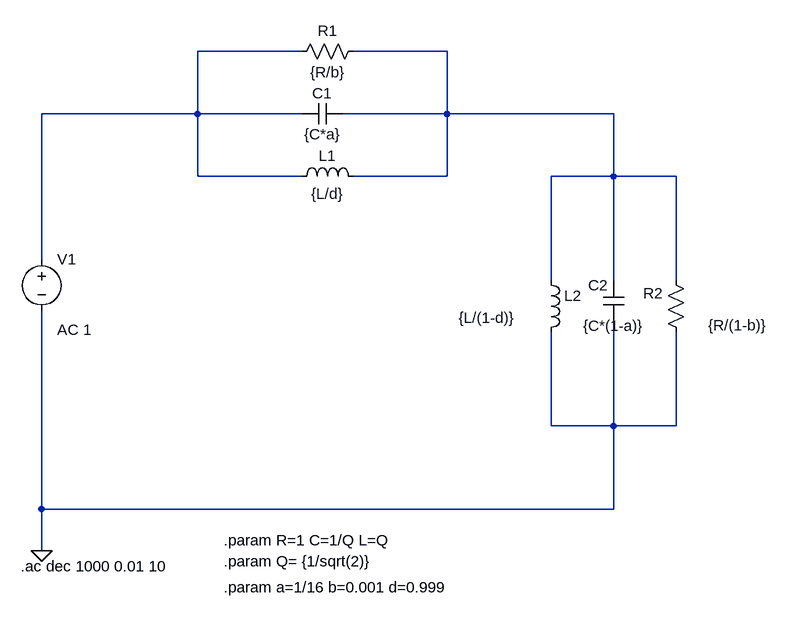
[diagram p0: schematic ej2b.asc]
ej2b.asc, the LTspice schematic file:
Version 4
SHEET 1 880 936
WIRE -848 96 -1008 96
WIRE -624 96 -768 96
WIRE -1008 192 -1008 96
WIRE -1008 192 -1248 192
WIRE -848 192 -1008 192
WIRE -624 192 -624 96
WIRE -624 192 -784 192
WIRE -368 192 -624 192
WIRE -1008 288 -1008 192
WIRE -848 288 -1008 288
WIRE -624 288 -624 192
WIRE -624 288 -768 288
WIRE -368 288 -368 192
WIRE -368 288 -464 288
WIRE -272 288 -368 288
WIRE -1248 416 -1248 192
WIRE -464 448 -464 288
WIRE -368 448 -368 288
WIRE -272 448 -272 288
WIRE -464 672 -464 528
WIRE -368 672 -368 512
WIRE -368 672 -464 672
WIRE -272 672 -272 528
WIRE -272 672 -368 672
WIRE -1248 800 -1248 496
WIRE -368 800 -368 672
WIRE -368 800 -1248 800
WIRE -1248 864 -1248 800
FLAG -1248 864 0
SYMBOL res -752 80 R90
WINDOW 0 0 56 VBottom 2
WINDOW 3 32 56 VTop 2
SYMATTR InstName R1
SYMATTR Value {R/b}
SYMBOL cap -784 176 R90
WINDOW 0 0 32 VBottom 2
WINDOW 3 32 32 VTop 2
SYMATTR InstName C1
SYMATTR Value {C*a}
SYMBOL ind -864 304 R270
WINDOW 0 32 56 VTop 2
WINDOW 3 5 56 VBottom 2
SYMATTR InstName L1
SYMATTR Value {L/d}
SYMBOL res -256 544 R180
WINDOW 0 36 76 Left 2
WINDOW 3 -126 27 Left 2
SYMATTR InstName R2
SYMATTR Value {R/(1-b)}
SYMBOL cap -352 512 R180
WINDOW 0 24 56 Left 2
WINDOW 3 -32 -6 Left 2
SYMATTR InstName C2
SYMATTR Value {C*(1-a)}
SYMBOL ind -480 432 R0
WINDOW 3 -126 74 Left 2
SYMATTR Value {L/(1-d)}
SYMATTR InstName L2
SYMBOL voltage -1248 400 R0
WINDOW 123 24 124 Left 2
WINDOW 39 0 0 Left 0
SYMATTR Value2 AC 1
SYMATTR InstName V1
SYMATTR Value ""
TEXT -968 848 Left 2 !.param R=1 C=1/Q L=Q
TEXT -968 880 Left 2 !.param Q= {1/sqrt(2)}
TEXT -968 920 Left 2 !.param a=1/16 b=0.001 d=0.999
TEXT -1280 888 Left 2 !.ac dec 1000 0.01 10

The netlist it stands for:
* ej2b.asc
R1 N002 N001 {R/b}
C1 N002 N001 {C*a}
L1 N001 N002 {L/d}
R2 0 N002 {R/(1-b)}
C2 0 N002 {C*(1-a)}
L2 N002 0 {L/(1-d)}
V1 N001 0 AC 1
.param R=1 C=1/Q L=Q
.param Q= {1/sqrt(2)}
.param a=1/16 b=0.001 d=0.999
.ac dec 1000 0.01 10
.backanno
.end